# EAGLE design Mainboard (EAGLE 9.6.2)

## Sheet 1 of 6
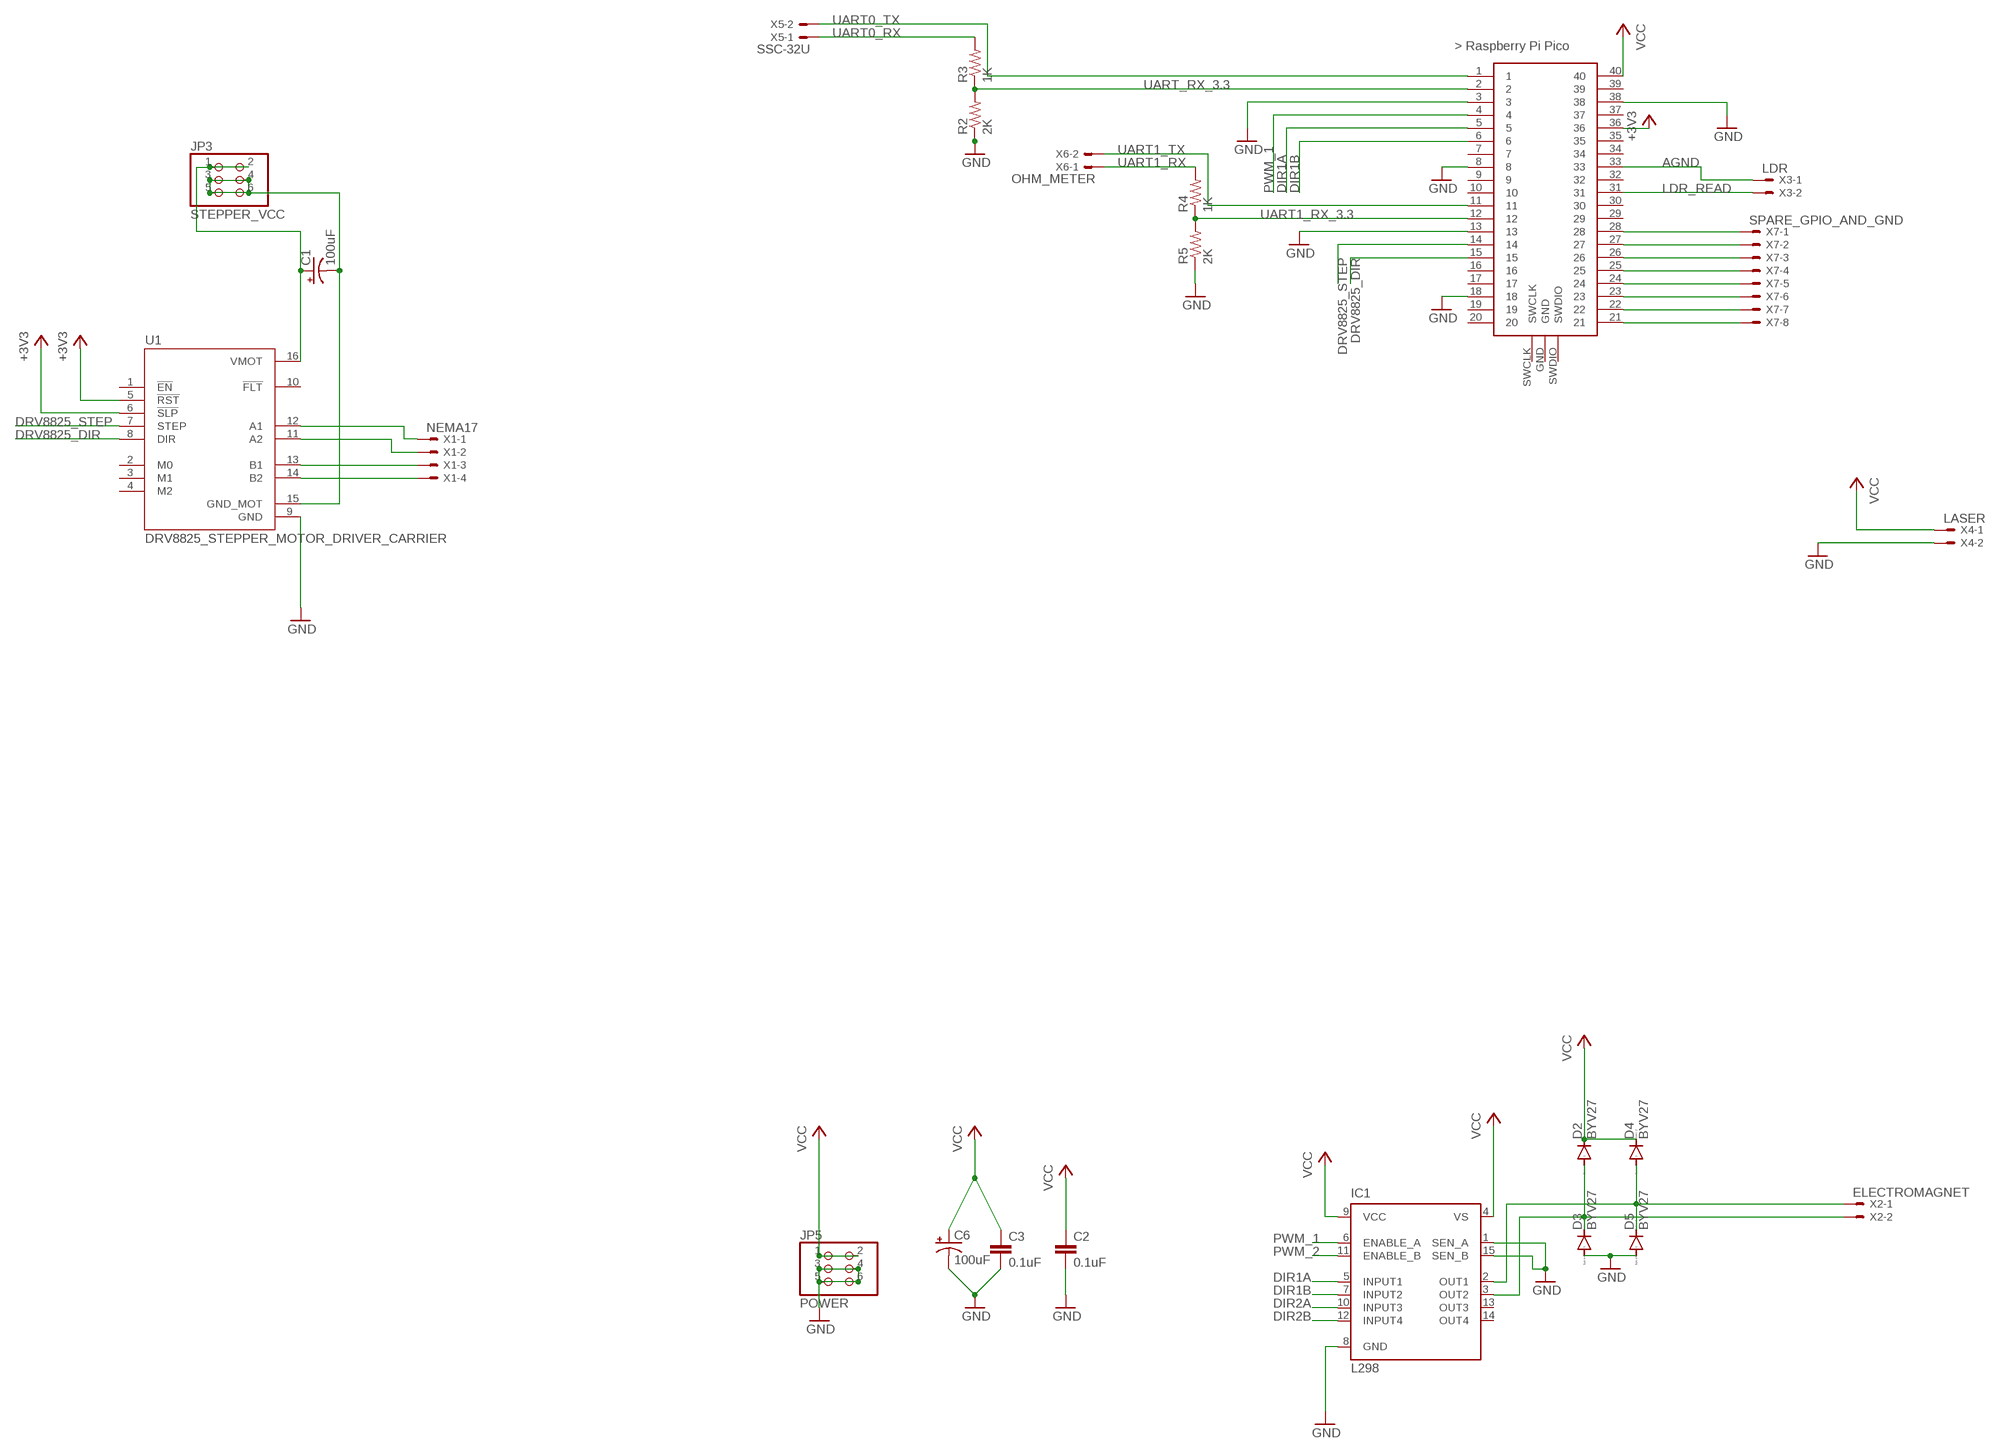
[diagram p0: schematic, sheet 1]

### Parts
C1  100uF  100UF-POLAR-RADIAL-2.5MM-25V-20%  [CPOL-RADIAL-2.5MM-6.5MM]
C2  0.1uF  0.1UF-0603-25V-5%  [0603]
C3  0.1uF  0.1UF-0603-25V-5%  [0603]
C6  100uF  100UF-POLAR-RADIAL-2.5MM-25V-20%  [CPOL-RADIAL-2.5MM-6.5MM]
D2  BYV27  [SOD57-10]
D3  BYV27  [SOD57-10]
D4  BYV27  [SOD57-10]
D5  BYV27  [SOD57-10]
IC1  L298  [MULTIWATT-15]
JP3  STEPPER_VCC  PINHD-2X3  [2X03]
JP5  POWER  PINHD-2X3  [2X03]
R2  2K  R-US_R0603  [R0603]
R3  1K  R-US_R0603  [R0603]
R4  1K  R-US_R0603  [R0603]
R5  2K  R-US_R0603  [R0603]
U1  DRV8825_STEPPER_MOTOR_DRIVER_CARRIER  [IC_DRV8825_STEPPER_MOTOR_DRIVER_CARRIER]
U$1  RASPBERRY-PI-PICO_W  RASPBERRY-PI-PICO_TH  [FT_RASPBERRY-PI-PICO_TH]
X1  NEMA17  22-23-2041  [22-23-2041]
X2  ELECTROMAGNET  22-23-2021  [22-23-2021]
X3  LDR  22-23-2021  [22-23-2021]
X4  LASER  22-23-2021  [22-23-2021]
X5  SSC-32U  22-23-2021  [22-23-2021]
X6  OHM_METER  22-23-2021  [22-23-2021]
X7  SPARE_GPIO_AND_GND  22-23-2081  [22-23-2081]

### Nets
+3V3: U1.5(!RST) U1.6(!SLP) U$1.36
+5V: C2.1 IC1.9(VCC) ; supply symbol labelled VCC
AGND: U$1.33 X3.1
DIR1A: IC1.5(INPUT1) U$1.5
DIR1B: IC1.7(INPUT2) U$1.6
DIR2A: IC1.10(INPUT3)
DIR2B: IC1.12(INPUT4)
DRV8825_DIR: U1.8(DIR) U$1.15
DRV8825_STEP: U1.7(STEP) U$1.14
GND: C2.2 C3.2 C6.2(-) D3.A D5.A IC1.1(SEN_A) IC1.8(GND) IC1.15(SEN_B) JP5.3 JP5.4 JP5.5 JP5.6 R2.1 R5.1 U1.9(GND) U$1.3 U$1.8 U$1.13 U$1.18 U$1.38 X4.2
LDR_READ: U$1.31 X3.2
MOTOR_1_+: D4.A D5.C IC1.2(OUT1) X2.1
MOTOR_1_-: D2.A D3.C IC1.3(OUT2) X2.2
N$1: C1.1(+) JP3.1 JP3.2 U1.16(VMOT)
N$2: C1.2(-) JP3.3 JP3.4 JP3.5 JP3.6 U1.15(GND_MOT)
N$3: U1.12(A1) X1.1
N$4: U1.11(A2) X1.2
N$5: U1.13(B1) X1.3
N$6: U1.14(B2) X1.4
N$9: U$1.21 X7.8
N$10: U$1.22 X7.7
N$11: U$1.25 X7.4
N$12: U$1.23 X7.6
N$13: U$1.24 X7.5
N$14: U$1.26 X7.3
N$15: U$1.27 X7.2
N$16: U$1.28 X7.1
PWM_1: IC1.6(ENABLE_A) U$1.4
PWM_2: IC1.11(ENABLE_B)
UART0_RX: R3.2 X5.1
UART0_TX: U$1.1 X5.2
UART1_RX: R4.2 X6.1
UART1_RX_3.3: R4.1 R5.2 U$1.12
UART1_TX: U$1.11 X6.2
UART_RX_3.3: R2.2 R3.1 U$1.2
VCC: C3.1 C6.1(+) D2.C D4.C IC1.4(VS) JP5.1 JP5.2 U$1.40 X4.1
Unconnected: IC1.13(OUT3) IC1.14(OUT4) U1.1(!EN) U1.2(M0) U1.3(M1) U1.4(M2) U1.10(!FLT) U$1.7 U$1.9 U$1.10 U$1.16 U$1.17 U$1.19 U$1.20 U$1.29 U$1.30 U$1.32 U$1.34 U$1.35 U$1.37 U$1.39 U$1.GND U$1.SWCLK U$1.SWDIO

## Sheet 2 of 6

## Sheet 3 of 6

## Sheet 4 of 6

## Sheet 5 of 6

## Sheet 6 of 6

## Library data of the parts
C1 C6 = SparkFun-Capacitors:100UF-POLAR: 100µF polarized capacitors A capacitor is a passive two-terminal electrical component used to store electrical energy temporarily in an electric field.; PROD_ID: CAP-08439
C2 C3 = SparkFun-Capacitors:0.1UF: 0.1µF ceramic capacitors A capacitor is a passive two-terminal electrical component used to store electrical energy temporarily in an electric field.; PROD_ID: CAP-08604
D2-D5 = diode:BYV27: DIODE ultra fast
IC1 = st-microelectronics:L298: DUAL FULL-BRIDGE DRIVER; MPN: L298N; OC_FARNELL: 1589425; OC_NEWARK: 32M1527
JP3 JP5 = pinhead:PINHD-2X3: PIN HEADER
R2-R5 = adafruit:R-US_: RESISTOR, American symbol; SPICEPREFIX: R
U1 = DRV8825_STEPPER_MOTOR_DRIVER_CARRIER:DRV8825_STEPPER_MOTOR_DRIVER_CARRIER: Stepper motor controler; IC: DRV8825; 1.5A; Uin mot: 8.2÷45V Check availability <https://pricing.snapeda.com/parts/DRV8825%20STEPPER%20MOTOR%20DRIVER%20CARRIER/Pololu/view-part?ref=eda>; AVAILABILITY: Not in stock; DESCRIPTION: Stepper, Bipolar 8.2 ~ 45VDC Supply 1.5A 8.2 ~ 45V Load; MF: Pololu; MP: DRV8825 STEPPER MOTOR DRIVER CARRIER; PACKAGE: None; PRICE: None
U$1 = pipico:RASPBERRY-PI-PICO_TH: Raspberry Pi Pico microcontroller board for through-hole mounting.; SPICEPREFIX: X
X1 = con-molex:22-23-2041: .100" (2.54mm) Center Header - 4 Pin; MF: MOLEX; MPN: 22-23-2041; OC_FARNELL: 1462920; OC_NEWARK: 38C0355
X2 X4 = con-molex:22-23-2021: .100" (2.54mm) Center Header - 2 Pin; MF: MOLEX; MPN: 22-23-2021; OC_FARNELL: 1462926; OC_NEWARK: 25C3832
X3 X5 X6 = con-molex:22-23-2021: .100" (2.54mm) Center Header - 2 Pin; MF: MOLEX; MPN: 22-23-2021; OC_FARNELL: 1462926; OC_NEWARK: 25C3832; SPICEPREFIX: X
X7 = con-molex:22-23-2081: .100" (2.54mm) Center Header - 8 Pin; MF: MOLEX; MPN: 22-23-2081; OC_FARNELL: 1756826; OC_NEWARK: 01C7592; SPICEPREFIX: X

## Board
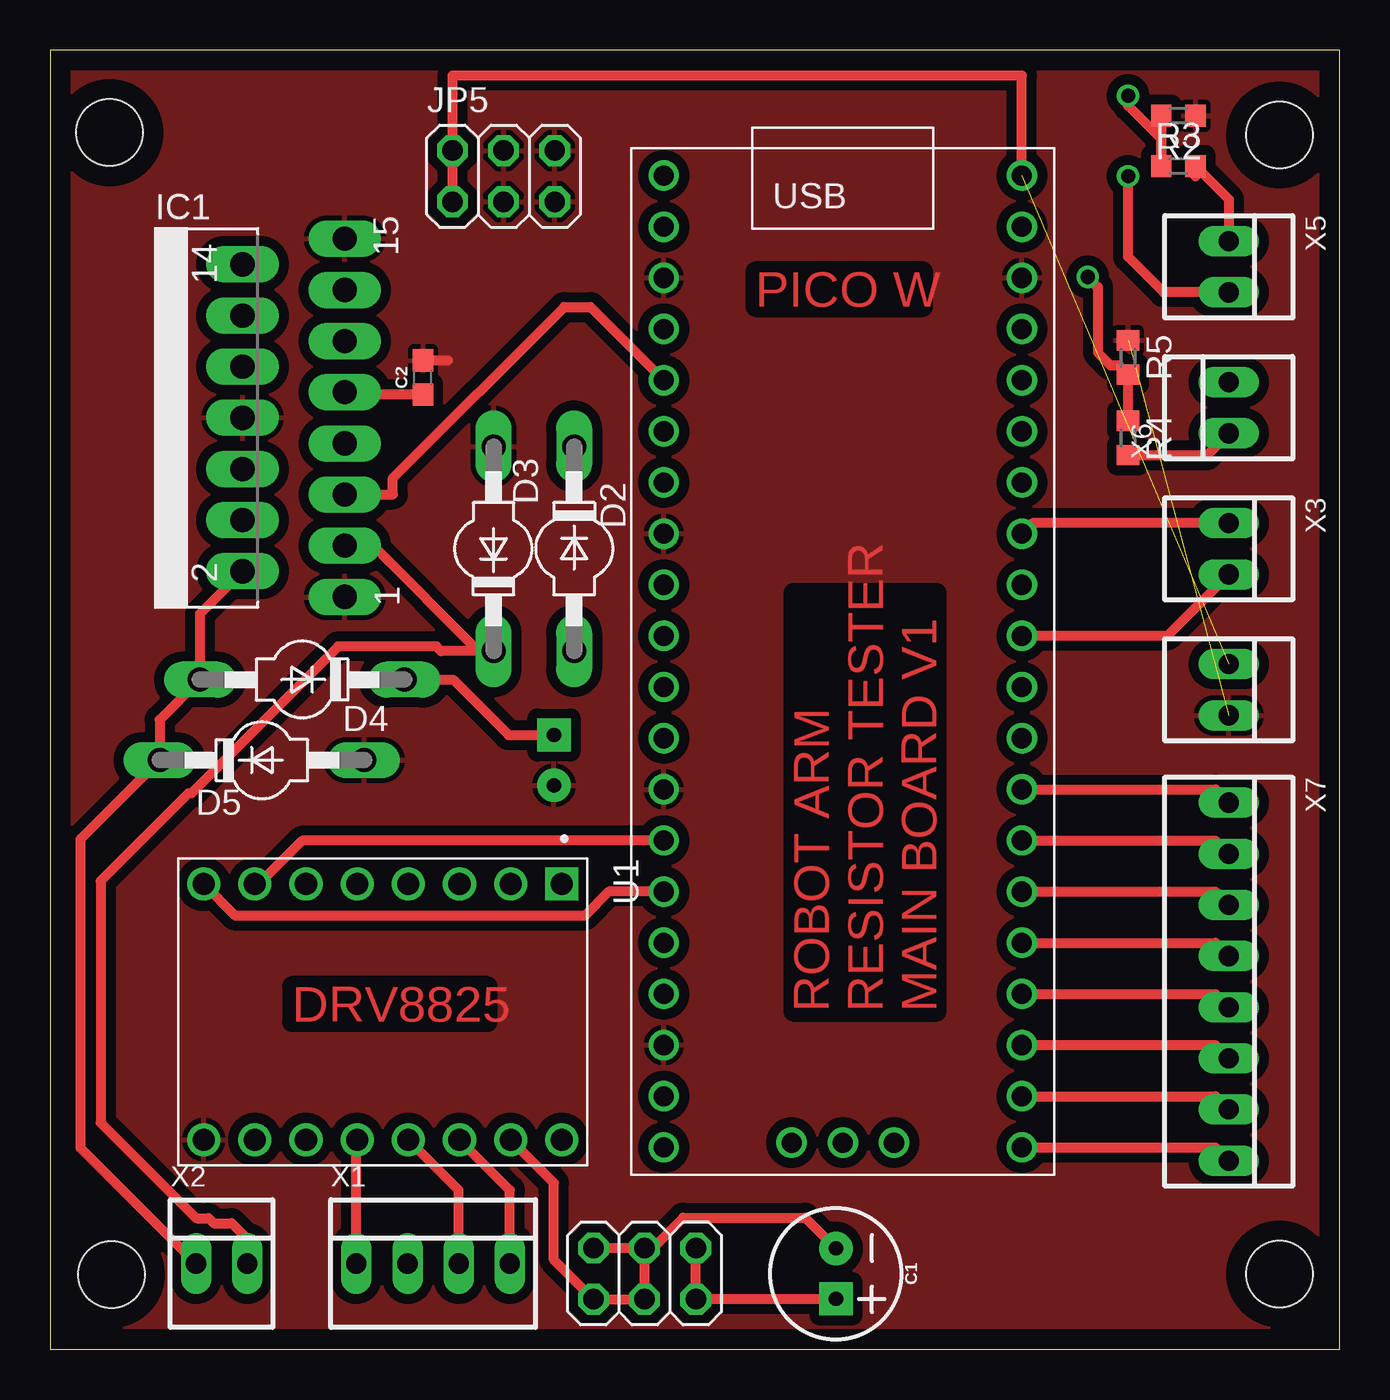
[diagram p1: board, top side]
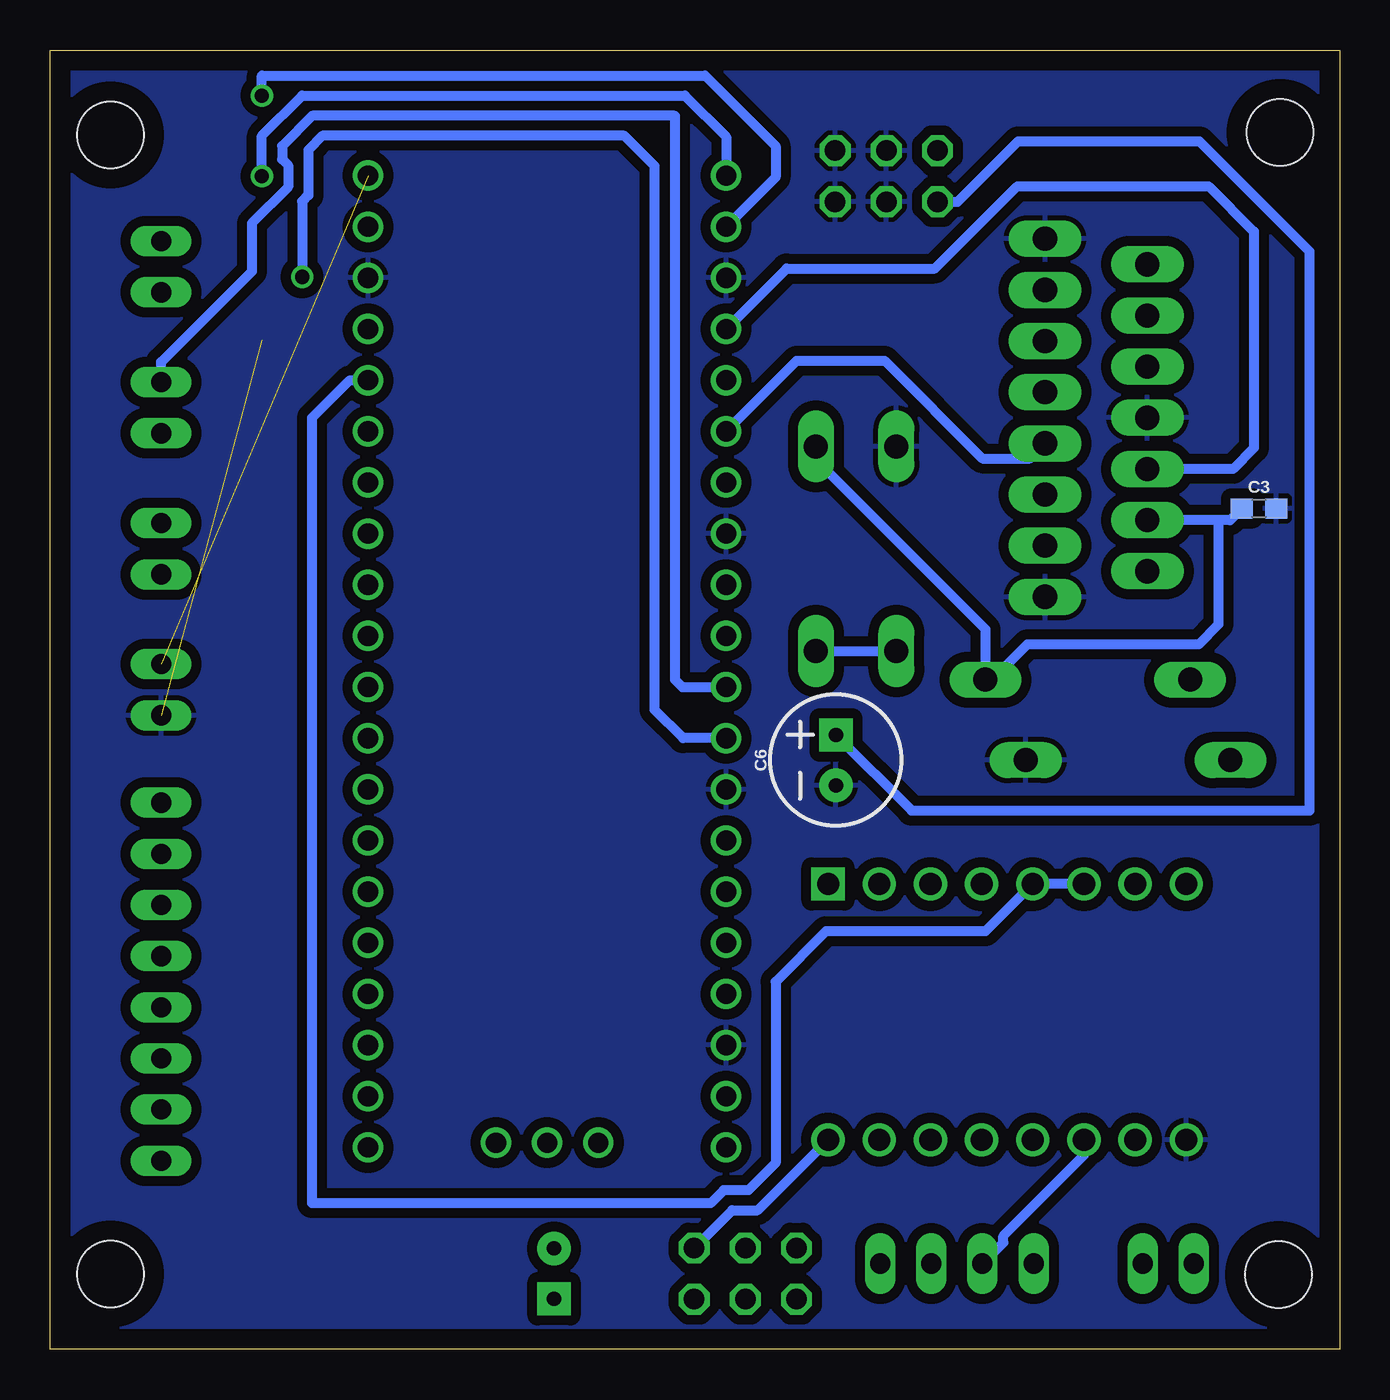
[diagram p2: board, bottom side, seen from below]

Size 64 x 64.5 mm. Coordinates in mm from the lower left corner, seen from the top.
Outline: 64,0 64,64.5 0,64.5 0,0 64,0
Copper layers (1*16): Top 0.035mm / dielectric 1.5mm / Bottom 0.035mm
Design rules "UWE_Router_Std_SS&DS": minimum track width 0.5mm, minimum drill 0.7mm, track to track 0.5mm, track to pad 0.5mm, pad to pad 0.5mm, via to via 0.5mm, smd to smd 0.5mm, copper to edge 1mm, drill to drill 0.2mm, minimum pad ring 10mil, minimum via ring 8mil, stop-mask expansion 4mil, vias tented up to drill 0mil, thermal gap 0.25mm
Holes 3.3 mm at 61.02,3.73 2.95,60.41 61.02,60.3 3.04,3.7

### Footprints (pad centres in the part's own frame; a part is rotated, then mirrored left to right if it is on the bottom)
CPOL-RADIAL-2.5MM-6.5MM = drill 0.7 pad 1.651 square: 1 1.25,0 | drill 0.7 pad 1.651: 2 -1.25,0
0603 = smd 1.1 x 1: 1 -0.85,0; 2 0.85,0
SOD57-10 = drill 1.194 long: A 5.08,0; C -5.08,0
MULTIWATT-15 = drill 1.2 long: 1 -8.89,-7.62; 2 -7.62,-2.54; 3 -6.35,-7.62; 4 -5.08,-2.54; 5 -3.81,-7.62; 6 -2.54,-2.54; 7 -1.27,-7.62; 8 0,-2.54; 9 1.27,-7.62; 10 2.54,-2.54; 11 3.81,-7.62; 12 5.08,-2.54; 13 6.35,-7.62; 14 7.62,-2.54; 15 8.89,-7.62
2X03 = drill 1.016 octagon: 1 -2.54,-1.27; 2 -2.54,1.27; 3 0,-1.27; 4 0,1.27; 5 2.54,-1.27; 6 2.54,1.27
R0603 = smd 1 x 1.1: 1 -0.85,0; 2 0.85,0
IC_DRV8825_STEPPER_MOTOR_DRIVER_CARRIER = drill 1.1 square: 1 -6.35,8.89 | drill 1.1: 2 -6.35,6.35; 3 -6.35,3.81; 4 -6.35,1.27; 5 -6.35,-1.27; 6 -6.35,-3.81; 7 -6.35,-6.35; 8 -6.35,-8.89; 9 6.35,-8.89; 10 6.35,-6.35; 11 6.35,-3.81; 12 6.35,-1.27; 13 6.35,1.27; 14 6.35,3.81; 15 6.35,6.35; 16 6.35,8.89
FT_RASPBERRY-PI-PICO_TH = drill 1: 1 -8.55,24.03; 2 -8.55,21.49; 3 -8.55,18.95; 4 -8.55,16.41; 5 -8.55,13.87; 6 -8.55,11.33; 7 -8.55,8.79; 8 -8.55,6.25; 9 -8.55,3.71; 10 -8.55,1.17; 11 -8.55,-1.37; 12 -8.55,-3.91; 13 -8.55,-6.45; 14 -8.55,-8.99; 15 -8.55,-11.53; 16 -8.55,-14.07; 17 -8.55,-16.61; 18 -8.55,-19.15; 19 -8.55,-21.69; 20 -8.55,-24.23; 21 9.23,-24.23; 22 9.23,-21.69; 23 9.23,-19.15; 24 9.23,-16.61; 25 9.23,-14.07; 26 9.23,-11.53; 27 9.23,-8.99; 28 9.23,-6.45; 29 9.23,-3.91; 30 9.23,-1.37; 31 9.23,1.17; 32 9.23,3.71; 33 9.23,6.25; 34 9.23,8.79; 35 9.23,11.33; 36 9.23,13.87; 37 9.23,16.41; 38 9.23,18.95; 39 9.23,21.49; 40 9.23,24.03; GND 0.34,-24; SWCLK -2.2,-24; SWDIO 2.88,-24
22-23-2041 = drill 1 long: 1 -3.81,0; 2 -1.27,0; 3 1.27,0; 4 3.81,0
22-23-2021 = drill 1 long: 1 -1.27,0; 2 1.27,0
22-23-2081 = drill 1 long: 1 -8.89,0; 2 -6.35,0; 3 -3.81,0; 4 -1.27,0; 5 1.27,0; 6 3.81,0; 7 6.35,0; 8 8.89,0

### Placement (x,y rotation side)
C1  39,3.75 270 top
C2  18.5,48.25 90 top
C3  4,41.75 0 bottom
C6  25,29.25 90 bottom
D2  26,39.75 270 top
D3  22,39.75 90 top
D4  12.5,33.25 180 top
D5  10.5,29.25 0 top
IC1  7,46.25 90 top
JP3  29.5,3.75 180 top
JP5  22.5,58.25 0 top
R2  56,61.25 180 top
R3  56,58.75 0 top
R4  53.5,45.25 270 top
R5  53.5,49.25 270 top
U1  16.5,16.75 270 top
U$1  39,34.25 0 top
X1  19,4.25 0 top
X2  8.5,4.25 0 top
X3  58.5,39.75 270 top
X4  58.5,32.75 270 top
X5  58.5,53.75 270 top
X6  58.5,46.75 90 top
X7  58.5,18.25 270 top

### Tracks (layer width: path | path; a pad name or v marks a point on that pad's centre or on a via)
+3V3
  Bottom 0.5: U1.6 U1.5 17.58,20.75 25.5,20.75 28,18.25 28,9.25 29.35,7.9 30.57,7.9 31.22,7.25 51,7.25 51,46.25 49.13,48.12 U$1.36
+5V
  Top 0.5: IC1.9 14.74,47.4 C2.1
AGND
  Top 0.5: X3.1 48.75,41.02 U$1.33
DIR1A
  Top 0.5: IC1.5 17,42.44 17,43.25 25.5,51.75 26.82,51.75 U$1.5
DIR1B
  Bottom 0.5: IC1.7 15.37,44.23 17.73,44.23 22.58,49.08 26.95,49.08 U$1.6
DRV8825_DIR
  Top 0.5: U$1.15 27.72,22.72 26.53,21.52 9.18,21.52 U1.8
DRV8825_STEP
  Top 0.5: U$1.14 12.51,25.26 10.35,23.1 U1.7
GND  (1 unrouted)
  Top 0.5: 19.73,49.1 C2.2
  pour Top: -2,66.75 -2,-0.75 67,-0.75 67,66.75
  pour Bottom: -1.5,65.25 -1.5,-0.75 67,-0.75 67,65.25
LDR_READ
  Top 0.5: X3.2 55.44,35.42 U$1.31
MOTOR_1_+
  Top 0.5: IC1.2 7.42,36.51 D4.A 5.42,31.25 D5.C 1.5,25.33 1.5,9.98 X2.1
MOTOR_1_-
  Top 0.5: IC1.3 16.02,39.9 21.25,34.67 D3.C 19.38,34.67 19.16,34.9 14.29,34.9 7,27.6 6.86,27.6 2.5,23.25 2.5,11.25 7.24,6.51 7.85,6.51 8.11,6.25 9,6.25 9.77,5.48 X2.2
  Bottom 0.5: D2.A D3.C
N$1
  Top 0.5: JP3.1 JP3.2 38.98,2.48 C1.1
  Bottom 0.5: JP3.1 30.16,6.9 28.89,6.9 U1.16
N$2
  Top 0.5: U1.15 25,8.25 25,4.44 JP3.6 JP3.4 JP3.3 | JP3.3 JP3.5 | JP3.3 29.9,5.02 31.41,6.53 37.47,6.53 C1.2
N$3
  Top 0.5: X1.1 15.19,10.36 U1.12
N$4
  Bottom 0.5: X1.2 16.69,5.29 16.69,5.63 12.69,9.63 U1.11
N$5
  Top 0.5: X1.3 20.27,7.9 U1.13
N$6
  Top 0.5: X1.4 22.81,7.9 U1.14
N$9
  Top 0.5: U$1.21 57.84,10.02 X7.8
N$10
  Top 0.5: U$1.22 57.84,12.56 X7.7
N$11
  Top 0.5: U$1.25 57.84,20.18 X7.4
N$12
  Top 0.5: U$1.23 57.84,15.1 X7.6
N$13
  Top 0.5: U$1.24 57.84,17.64 X7.5
N$14
  Top 0.5: U$1.26 57.84,22.72 X7.3
N$15
  Top 0.5: U$1.27 57.84,25.26 X7.2
N$16
  Top 0.5: U$1.28 57.84,27.8 X7.1
PWM_1
  Bottom 0.5: IC1.6 5.29,43.71 4.25,44.75 4.25,55.5 6.5,57.75 16,57.75 20.09,53.66 27.45,53.66 U$1.4
UART0_RX
  Top 0.5: 56.85,58.25 R3.2 58.5,57.1 X5.1
UART0_TX  (via drill 0.7)
  Top 0.5: X5.2 55.27,52.48 53.5,54.25 v53.5,58.25
  Bottom 0.5: U$1.1 30.45,60.2 32.5,62.25 51.5,62.25 53.5,60.25 v53.5,58.25
UART1_RX
  Top 0.5: R4.2 57.42,44.4 X6.1
UART1_RX_3.3  (via drill 0.7)
  Top 0.5: R4.1 R5.2 53.05,48.85 52.64,48.85 52,49.49 52,52.75 v51.5,53.25
  Bottom 0.5: U$1.12 32.59,30.34 34,31.75 34,58.75 35.5,60.25 50.5,60.25 51.2,59.55 51.2,57.3 51.5,56.99 v51.5,53.25
UART1_TX
  Bottom 0.5: X6.2 58.5,49.02 54,53.52 54,55.91 52.2,57.71 52.2,58.79 52.5,59.09 52.5,59.75 51,61.25 33,61.25 33,33.25 32.63,32.88 U$1.11
UART_RX_3.3  (via drill 0.7)
  Top 0.5: R2.2 R3.1 55.15,60.1 53.5,61.75 v53.5,62.25
  Bottom 0.5: v53.5,62.25 53.5,63.25 31.5,63.25 28,59.75 28,58.19 U$1.2
VCC  (1 unrouted)
  Top 0.5: 18.73,33.25 D4.C 20,33.25 22.75,30.5 C6.1 | U$1.40 48.23,63.25 19.96,63.25 JP5.2 JP5.1
  Bottom 0.5: D2.C 26,44.17 17.58,35.75 D4.C 17.25,33.25 15.5,35 7,35 6,36 6,41.17 | 6,41.17 5.43,41.17 C3.1 | 6,41.17 IC1.4 | JP5.1 18.96,56.98 15.96,59.98 6.96,59.98 1.5,54.52 1.5,26.75 21.25,26.75 C6.1

### Text on the board
Top: PICO W | DRV8825 | ROBOT ARM / RESISTOR TESTER / MAIN BOARD V1